# Altium schematic sheet Avalon-Series-Control-Board_2024-08-24.schdoc
size 398 x 312 mm
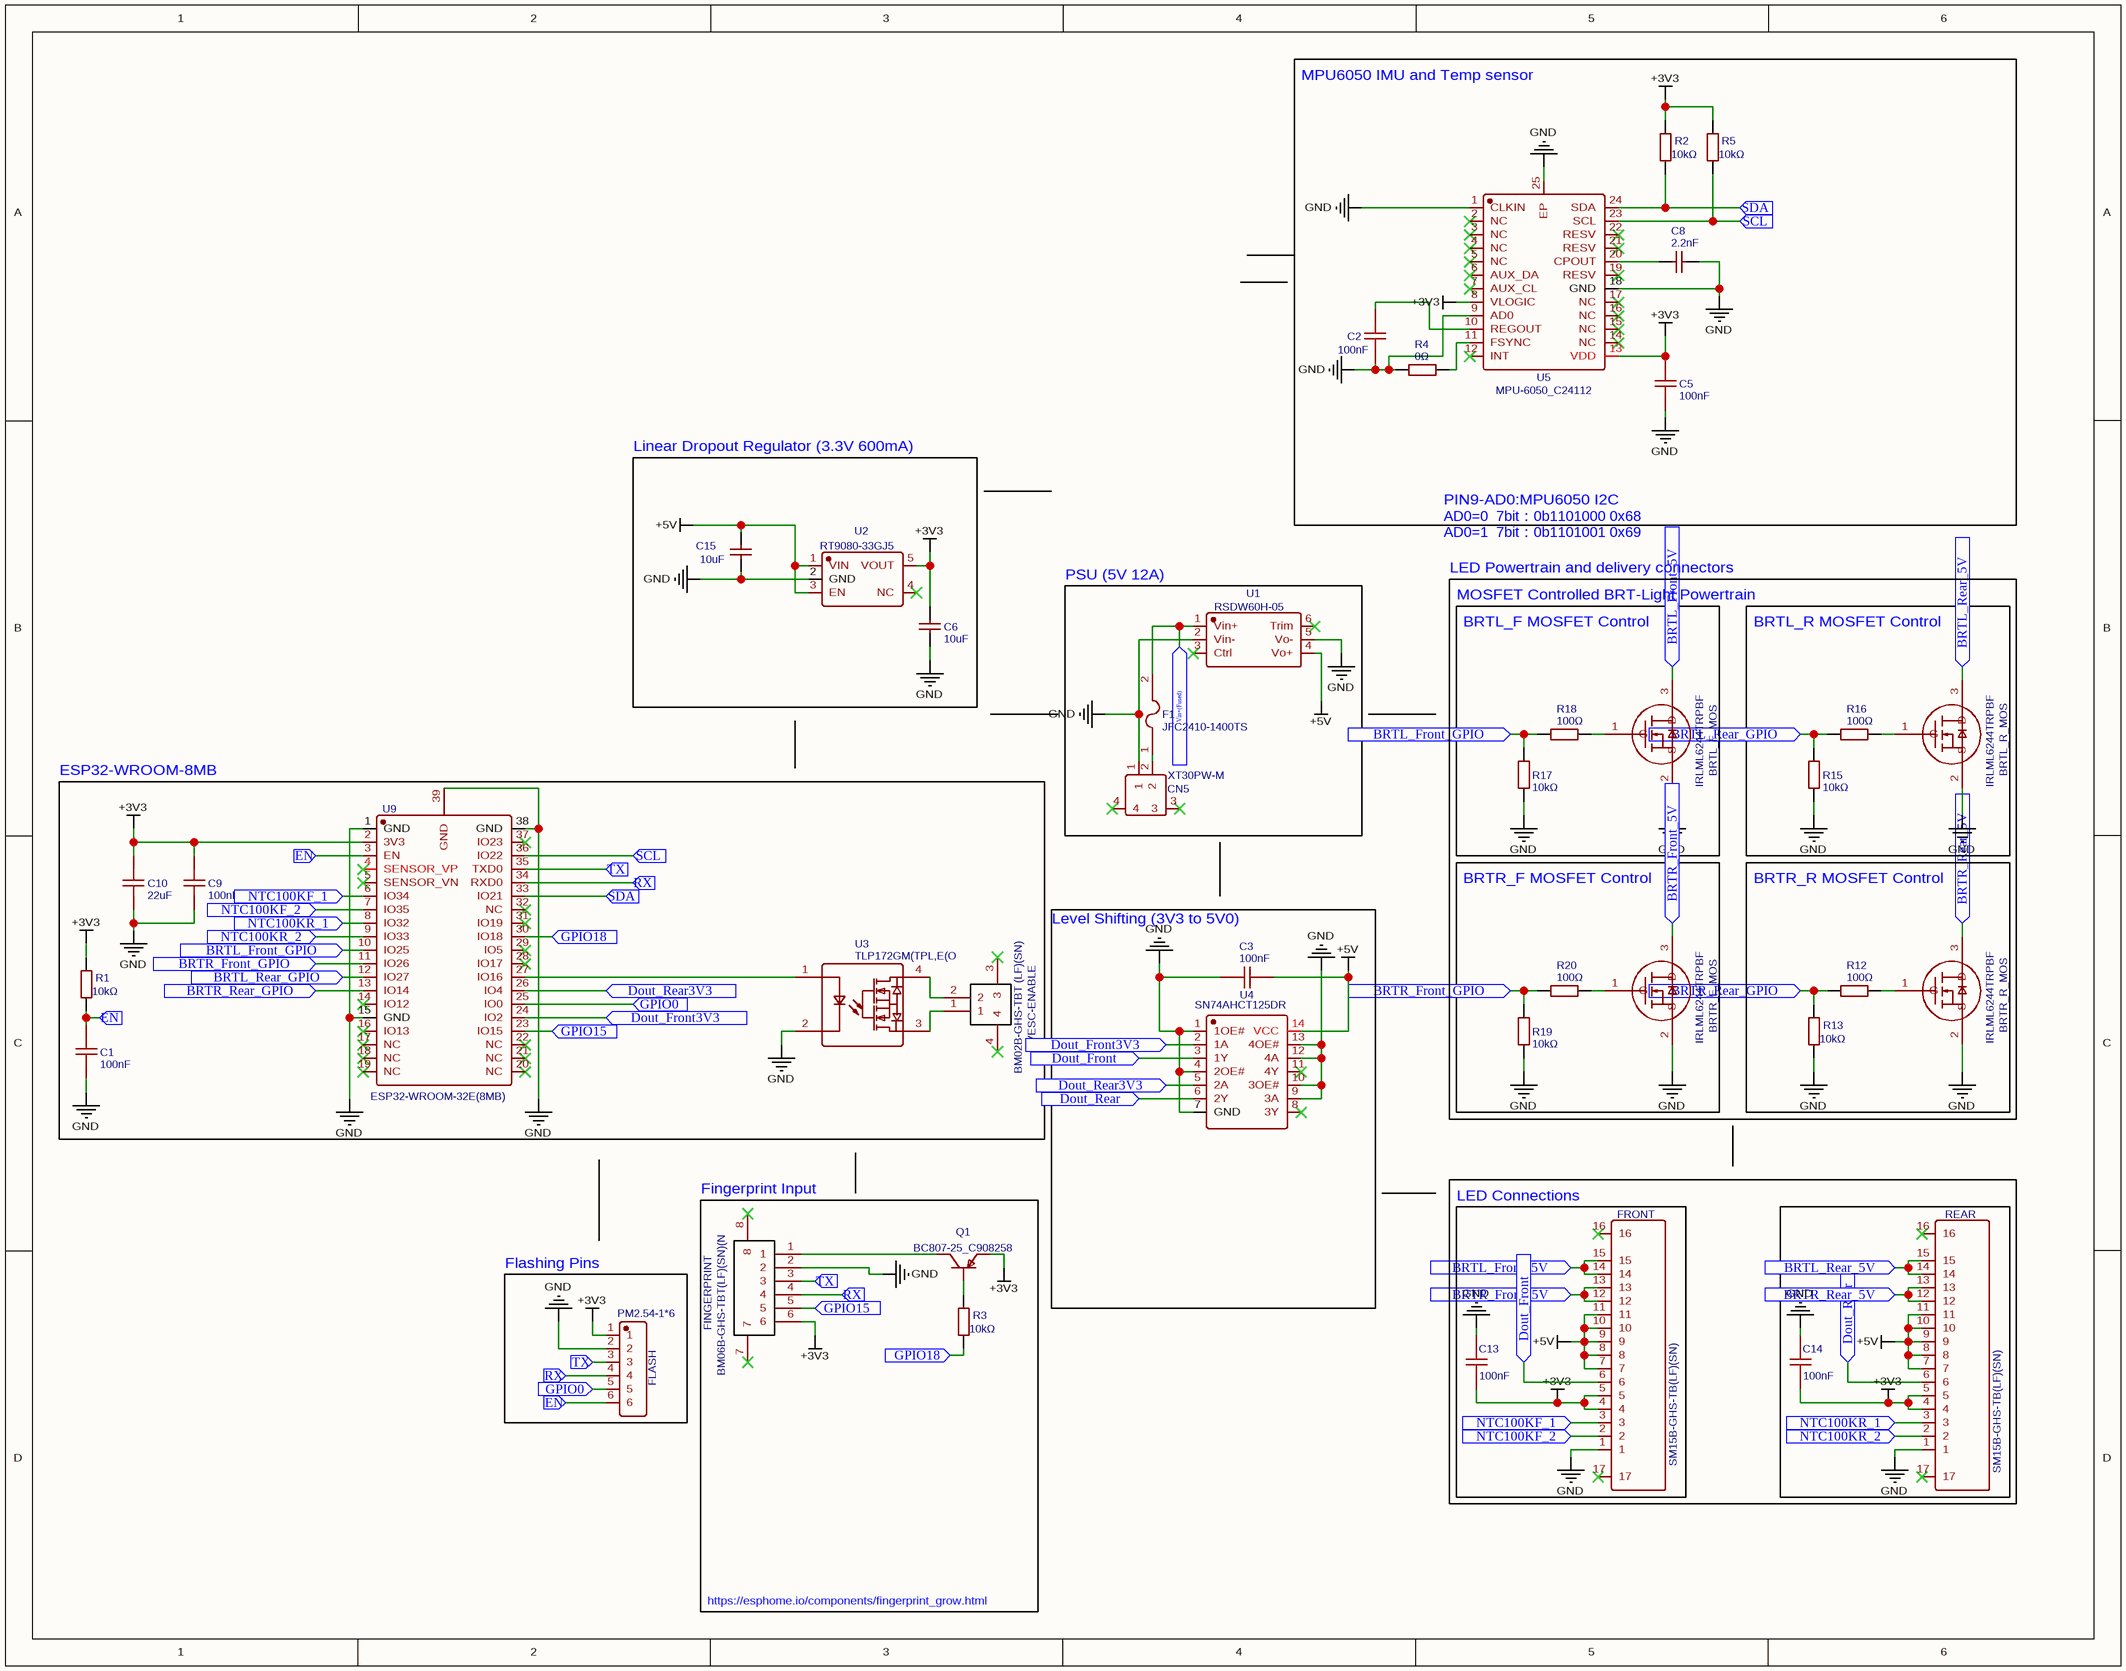
[diagram p0: Avalon-Series-Control-Board_2024-08-24.schdoc]

## Parts
BRTL_F_MOS  IRLML6244TRPBF  [SOT-23-3_L2.9-W1.3-P1.90-LS2.4-BR]
BRTL_R_MOS  IRLML6244TRPBF  [SOT-23-3_L2.9-W1.3-P1.90-LS2.4-BR]
BRTR_F_MOS  IRLML6244TRPBF  [SOT-23-3_L2.9-W1.3-P1.90-LS2.4-BR]
BRTR_R_MOS  IRLML6244TRPBF  [SOT-23-3_L2.9-W1.3-P1.90-LS2.4-BR]
C1  100nF  [C0603]
C2  100nF  [C0603]
C3  100nF  [C0603]
C5  100nF  [C0603]
C6  10uF  [C0402]
C8  2.2nF  [C0805]
C9  100nF  [C0603]
C10  22uF  [C0603]
C13  100nF  [C0603]
C14  100nF  [C0603]
C15  10uF  [C0402]
CN5  XT30PW-M  [CONN-TH_XT30PW-M]
F1  JFC2410-1400TS  [FUSE-SMD_L6.1-W2.6]
FINGERPRINT  BM06B-GHS-TBT(LF)(SN)(N  [CONN-SMD_6P-P1.25_BM06B-GHS-TBT-LF-SN-N]
FLASH  PM2.54-1*6  [HDR-TH_6P-P2.54-V-F]
FRONT  SM15B-GHS-TB(LF)(SN)  [CONN-SMD_15P-P1.25_SM15B-GHS-TB-LF-SN]
Q1  BC807-25_C908258  [SOT-23-3_L2.9-W1.3-P1.90-LS2.4-BR]
R1  10kΩ  [R0603]
R2  10kΩ  [R0603]
R3  10kΩ  [R0603]
R4  0Ω  [R0603]
R5  10kΩ  [R0603]
R12  100Ω  [R0603]
R13  10kΩ  [R0603]
R15  10kΩ  [R0603]
R16  100Ω  [R0603]
R17  10kΩ  [R0603]
R18  100Ω  [R0603]
R19  10kΩ  [R0603]
R20  100Ω  [R0603]
REAR  SM15B-GHS-TB(LF)(SN)  [CONN-SMD_15P-P1.25_SM15B-GHS-TB-LF-SN]
U1  RSDW60H-05  [RSDW60H-05]
U2  RT9080-33GJ5  [TSOT-23-5_L2.9-W1.6-P0.95-LS2.8-BL]
U3  TLP172GM(TPL,E(O  [SMD-4_L4.6-W3.7-P2.54-LS7.0-BR]
U4  SN74AHCT125DR  [SOIC-14_L8.7-W3.9-P1.27-LS6.0-BL]
U5  MPU-6050_C24112  [QFN-24_L4.0-W4.0-P0.50-BL-EP2.7]
U9  ESP32-WROOM-32E(8MB)  [WIFI-SMD_ESP32-WROOM-32E]
VESC-ENABLE  BM02B-GHS-TBT (LF)(SN)  [CONN-SMD_2P-P1.25_BM02B-GHS-TBT-LF-SN]

## Blocks framed on the sheet
MPU6050 IMU and Temp sensor: C2 C5 C8 R2 R4 R5 U5
Linear Dropout Regulator (3.3V 600mA): C6 C15 U2
PSU (5V 12A): CN5 F1 U1
BRTL_R MOSFET Control: BRTL_R_MOS R15 R16
ESP32-WROOM-8MB: C1 C9 C10 R1 U3 U9 VESC-ENABLE
BRTR_F MOSFET Control: BRTR_F_MOS R19 R20
BRTR_R MOSFET Control: BRTR_R_MOS R12 R13
Level Shifting (3V3 to 5V0): C3 U4
Fingerprint Input: FINGERPRINT Q1 R3
LED Connections: C13 FRONT
Flashing Pins: FLASH

## Ports
BRTL_Front_5V (in), BRTL_Front_GPIO (in), BRTL_Rear_5V (in), BRTL_Rear_GPIO (in), BRTR_Front_5V (in), BRTR_Front_GPIO (in), BRTR_Rear_5V (in), BRTR_Rear_GPIO (in), Dout_Front3V3 (in), Dout_Front (in), Dout_Rear3V3 (in), Dout_Rear (in), EN (in), GPIO0 (in), GPIO15 (in), GPIO18 (in), NTC100KF_1 (in), NTC100KF_2 (in), NTC100KR_1 (in), NTC100KR_2 (in), RX (in), SCL (in), SDA (in), TX (in), Vin+(Fused) (in)

## Nets
+3V3: C5.1 C6.2 C9.1 C10.1 C13.2 C14.2 FINGERPRINT.6 FLASH.1 FRONT.4 FRONT.5 Q1.2(E) R1.2 R2.2 R5.2 REAR.4 REAR.5 U2.5(VOUT) U5.8(VLOGIC) U5.13(VDD) U9.2(3V3)
+5V: C3.1 C15.2 FRONT.7 FRONT.8 FRONT.9 FRONT.10 FRONT.11 R19.2 R20.1 REAR.7 REAR.8 REAR.9 REAR.10 REAR.11 U1.4(Vo+) U2.1(VIN) U2.3(EN) U4.14(VCC) U9.11(IO26) ; port BRTR_Front_GPIO
GND: BRTL_F_MOS.2(S) BRTL_R_MOS.2(S) BRTR_F_MOS.2(S) BRTR_R_MOS.2(S) BRTR_R_MOS.3(D) C1.2 C2.2 C3.2 C5.2 C6.1 C8.2 C9.2 C10.2 C13.1 C14.1 C15.1 CN5.1 FINGERPRINT.2 FLASH.2 FRONT.1 R4.1 R13.1 R15.1 R17.1 R19.1 REAR.1 REAR.12 REAR.13 U1.2(Vin-) U1.5(Vo-) U2.2(GND) U3.2 U4.1(1OE#) U4.4(2OE#) U4.7(GND) U4.9(3A) U4.10(3OE#) U4.12(4A) U4.13(4OE#) U5.1(CLKIN) U5.9(AD0) U5.18(GND) U5.25(EP) U9.1(GND) U9.15(GND) U9.38(GND) U9.39(GND) ; port BRTR_Rear_5V
BRTL_Front_5V: BRTL_F_MOS.3(D) FRONT.14 FRONT.15 ; port BRTL_Front_5V
BRTL_Front_GPIO: R17.2 R18.1 U9.10(IO25) ; port BRTL_Front_GPIO
BRTL_Rear_5V: BRTL_R_MOS.3(D) REAR.14 REAR.15 ; port BRTL_Rear_5V
BRTL_Rear_GPIO: R15.2 R16.1 U9.12(IO27) ; port BRTL_Rear_GPIO
BRTR_Front_5V: BRTR_F_MOS.3(D) FRONT.12 FRONT.13 ; port BRTR_Front_5V
BRTR_Rear_GPIO: R12.1 R13.2 U9.13(IO14) ; port BRTR_Rear_GPIO
Dout_Front: FRONT.6 U4.3(1Y) ; port Dout_Front
Dout_Front3V3: U4.2(1A) U9.24(IO2) ; port Dout_Front3V3
Dout_Rear: REAR.6 U4.6(2Y) ; port Dout_Rear
Dout_Rear3V3: U4.5(2A) U9.26(IO4) ; port Dout_Rear3V3
EN: C1.1 FLASH.6 R1.1 U9.3(EN) ; port EN
GPIO0: FLASH.5 U9.25(IO0) ; port GPIO0
GPIO15: FINGERPRINT.5 U9.23(IO15) ; port GPIO15
GPIO18: R3.1 U9.30(IO18) ; port GPIO18
NTC100KF_1: FRONT.3 U9.6(IO34) ; port NTC100KF_1
NTC100KF_2: FRONT.2 U9.7(IO35) ; port NTC100KF_2
NTC100KR_1: REAR.3 U9.8(IO32) ; port NTC100KR_1
NTC100KR_2: REAR.2 U9.9(IO33) ; port NTC100KR_2
RX: FINGERPRINT.4 FLASH.4 U9.34(RXD0) ; port RX
SCL: R5.1 U5.23(SCL) U9.36(IO22) ; port SCL
SDA: R2.1 U5.24(SDA) U9.33(IO21) ; port SDA
TX: FINGERPRINT.3 FLASH.3 U9.35(TXD0) ; port TX
Vin+(Fused): F1.2 U1.1(Vin+) ; port Vin+(Fused)
NetBRTL_F_MOS_1: BRTL_F_MOS.1(G) R18.2
NetBRTL_R_MOS_1: BRTL_R_MOS.1(G) R16.2
NetBRTR_F_MOS_1: BRTR_F_MOS.1(G) R20.2
NetBRTR_R_MOS_1: BRTR_R_MOS.1(G) R12.2
NetC2_1: C2.1 U5.10(REGOUT)
NetC8_1: C8.1 U5.20(CPOUT)
NetCN5_2: CN5.2 F1.1
NetFINGERPRINT_1: FINGERPRINT.1 Q1.3(C)
NetQ1_1: Q1.1(B) R3.2
NetR4_2: R4.2 U5.11(FSYNC)
NetU3_1: U3.1 U9.27(IO16)
NetU3_3: U3.3 VESC-ENABLE.1
NetU3_4: U3.4 VESC-ENABLE.2

Not connected (* = marked no-connect by the designer): CN5 3* 4*; FINGERPRINT 7* 8*; FRONT 16* 17*; REAR 16* 17*; U1 3(Ctrl)* 6(Trim)*; U2 4(NC)*; U4 8(3Y)* 11(4Y)*; U5 2(NC)* 3(NC)* 4(NC)* 5(NC)* 6(AUX_DA)* 7(AUX_CL)* 12(INT)* 14(NC)* 15(NC)* 16(NC)* 17(NC)* 19(RESV)* 21(RESV)* 22(RESV)*; U9 4(SENSOR_VP)* 5(SENSOR_VN)* 14(IO12)* 16(IO13)* 17(NC)* 18(NC)* 19(NC)* 20(NC)* 21(NC)* 22(NC)* 28(IO17)* 29(IO5)* 31(IO19)* 32(NC)* 37(IO23)*; VESC-ENABLE 3* 4*

## Notes on the sheet
- PIN9-AD0:MPU6050 I2C
  AD0=0  7bit：0b1101000 0x68
  AD0=1  7bit：0b1101001 0x69
- LED Powertrain and delivery connectors
- MOSFET Controlled BRT-Light Powertrain
- BRTL_F MOSFET Control
- https://esphome.io/components/fingerprint_grow.html

## Library data of the parts
BRTL_F_MOS BRTL_R_MOS BRTR_F_MOS BRTR_R_MOS = IRLML6244TRPBF: Manufacturer: Infineon(英飞凌); Contributor: LCSC; Supplier: LCSC; Manufacturer Part: IRLML6244TRPBF; Supplier Part: C143946; JLCPCB Part Class: Extended Part; spicePre: Q; spiceSymbolName: IRLML6244TRPBF
C1-C3 C5 C9 C13 C14 = 100nF: Manufacturer: YAGEO(国巨); Manufacturer Part: CC0603KRX7R9BB104; nameAlias: Value; Supplier: LCSC; Supplier Part: C14663; JLCPCB Part Class: Basic Part; spicePre: C; spiceSymbolName: CC0603KRX7R9BB104
C6 C15 = 10uF: Manufacturer Part: CL05A106MQ5NUNC; Manufacturer: SAMSUNG(三星); nameAlias: Value; Supplier: LCSC; Supplier Part: C15525; JLCPCB Part Class: Basic Part; spicePre: C; spiceSymbolName: CL05A106MQ5NUNC
C8 = 2.2nF: Manufacturer Part: CL21C222JBFNNNE; Manufacturer: SAMSUNG(三星); nameAlias: Value; Supplier: LCSC; Supplier Part: C28260; JLCPCB Part Class: Basic Part; spicePre: C; spiceSymbolName: CL21C222JBFNNNE
C10 = 22uF: Manufacturer: SAMSUNG(三星); Manufacturer Part: CL10A226MQ8NRNC; nameAlias: Value; Supplier: LCSC; Supplier Part: C59461; JLCPCB Part Class: Basic Part; spicePre: C; spiceSymbolName: CL10A226MQ8NRNC
CN5 = XT30PW-M: Manufacturer: AMASS(艾迈斯); Contributor: LCSC; Supplier: LCSC; Supplier Part: C431092; Manufacturer Part: XT30PW-M; JLCPCB Part Class: Extended Part; spicePre: C; spiceSymbolName: XT30PW-M
F1 = JFC2410-1400TS: Manufacturer: JDTfuse(集电通); Contributor: LCSC; Supplier: LCSC; Manufacturer Part: JFC2410-1400TS; Supplier Part: C136386; JLCPCB Part Class: Extended Part; spicePre: F; spiceSymbolName: JFC2410-1400TS
FINGERPRINT = BM06B-GHS-TBT(LF)(SN)(N: Manufacturer: JST; Contributor: LCSC; Supplier: LCSC; Supplier Part: C189892; Manufacturer Part: BM06B-GHS-TBT(LF)(SN); JLCPCB Part Class: Extended Part; spicePre: U; spiceSymbolName: BM06B-GHS-TBT(LF)(SN)(N
FLASH = PM2.54-1*6: Manufacturer: ZHOURI(洲日); Contributor: lcsc; Supplier: LCSC; Supplier Part: C5224026; Manufacturer Part: PM2.54-1*6; JLCPCB Part Class: Extended Part; spicePre: U; spiceSymbolName: PM2.54-1*6
FRONT REAR = SM15B-GHS-TB(LF)(SN): Manufacturer: JST; Contributor: LCSC; Supplier: LCSC; Supplier Part: C265027; Manufacturer Part: SM15B-GHS-TB(LF)(SN); JLCPCB Part Class: Extended Part; spicePre: C; spiceSymbolName: SM15B-GHS-TB(LF)(SN)
Q1 = BC807-25_C908258: Manufacturer: FUXINSEMI(富芯森美); Contributor: LCSC; Supplier: LCSC; Supplier Part: C908258; Manufacturer Part: BC807-25; JLCPCB Part Class: Extended Part; spicePre: Q; spiceSymbolName: BC807-25_C908258
R1-R3 R5 R13 R15 R17 R19 = 10kΩ: Manufacturer: UNI-ROYAL(厚声); Manufacturer Part: 0603WAF1002T5E; nameAlias: Value; Supplier: LCSC; Supplier Part: C25804; JLCPCB Part Class: Basic Part; spicePre: R; spiceSymbolName: 0603WAF1002T5E
R4 = 0Ω: Manufacturer: UNI-ROYAL(厚声); Manufacturer Part: 0603WAF0000T5E; nameAlias: Value; Supplier: LCSC; Supplier Part: C21189; JLCPCB Part Class: Basic Part; spicePre: R; spiceSymbolName: 0603WAF0000T5E
R12 R16 R18 R20 = 100Ω: Manufacturer: UNI-ROYAL(厚声); Manufacturer Part: 0603WAF1000T5E; nameAlias: Value; Supplier: LCSC; Supplier Part: C22775; JLCPCB Part Class: Basic Part; spicePre: R; spiceSymbolName: 0603WAF1000T5E
U1 = RSDW60H-05: Manufacturer: MEAN WELL USA Inc.; Contributor: edwardkeate; Manufacturer Part: RSDW60H-05; Supplier: Digi-Key; Supplier Part: 1866-RSDW60H-05-ND; link: https://www.digikey.co.uk/short/zwqdqzjq; spicePre: U; spiceSymbolName: RSDW60H-05
U2 = RT9080-33GJ5: Manufacturer: RICHTEK(立锜); Contributor: LCSC; Supplier: LCSC; Supplier Part: C841192; Manufacturer Part: RT9080-33GJ5; JLCPCB Part Class: Extended Part; spicePre: U; spiceSymbolName: RT9080-33GJ5
U3 = TLP172GM(TPL,E(O: Manufacturer: TOSHIBA(东芝); Contributor: LCSC; Supplier: LCSC; Supplier Part: C261926; Manufacturer Part: TLP172GM(TPL,E(O; JLCPCB Part Class: Extended Part; spicePre: U; spiceSymbolName: TLP172GM(TPL,E(O
U4 = SN74AHCT125DR: Manufacturer: TI(德州仪器); Contributor: LCSC; Supplier: LCSC; Manufacturer Part: SN74AHCT125DR; Supplier Part: C155176; JLCPCB Part Class: Extended Part; spicePre: U; spiceSymbolName: SN74AHCT125DR
U5 = MPU-6050_C24112: Manufacturer: TDK InvenSense(应美盛); sourceId: 1T5FDZYC8; timeStamp: 1462265206; Supplier: LCSC; Manufacturer Part: MPU-6050; Supplier Part: C24112; JLCPCB Part Class: Extended Part; spicePre: U; spiceSymbolName: MPU-6050_C24112
U9 = ESP32-WROOM-32E(8MB): Manufacturer: Espressif Systems; Contributor: LCSC; Supplier: LCSC; Supplier Part: C701342; Manufacturer Part: ESP32-WROOM-32E(8MB); JLCPCB Part Class: Extended Part; spicePre: U; spiceSymbolName: ESP32-WROOM-32E(8MB)
VESC-ENABLE = BM02B-GHS-TBT (LF)(SN): Manufacturer: JST; Contributor: LCSC; Supplier: LCSC; Supplier Part: C161690; Manufacturer Part: BM02B-GHS-TBT(LF)(SN); JLCPCB Part Class: Extended Part; spicePre: C; spiceSymbolName: BM02B-GHS-TBT (LF)(SN)